# Altium schematic sheet [03] - RS232, JOYSTICK.SchDoc
size A4; DocumentNumber: 3; SheetNumber: 3; SheetTotal: 14
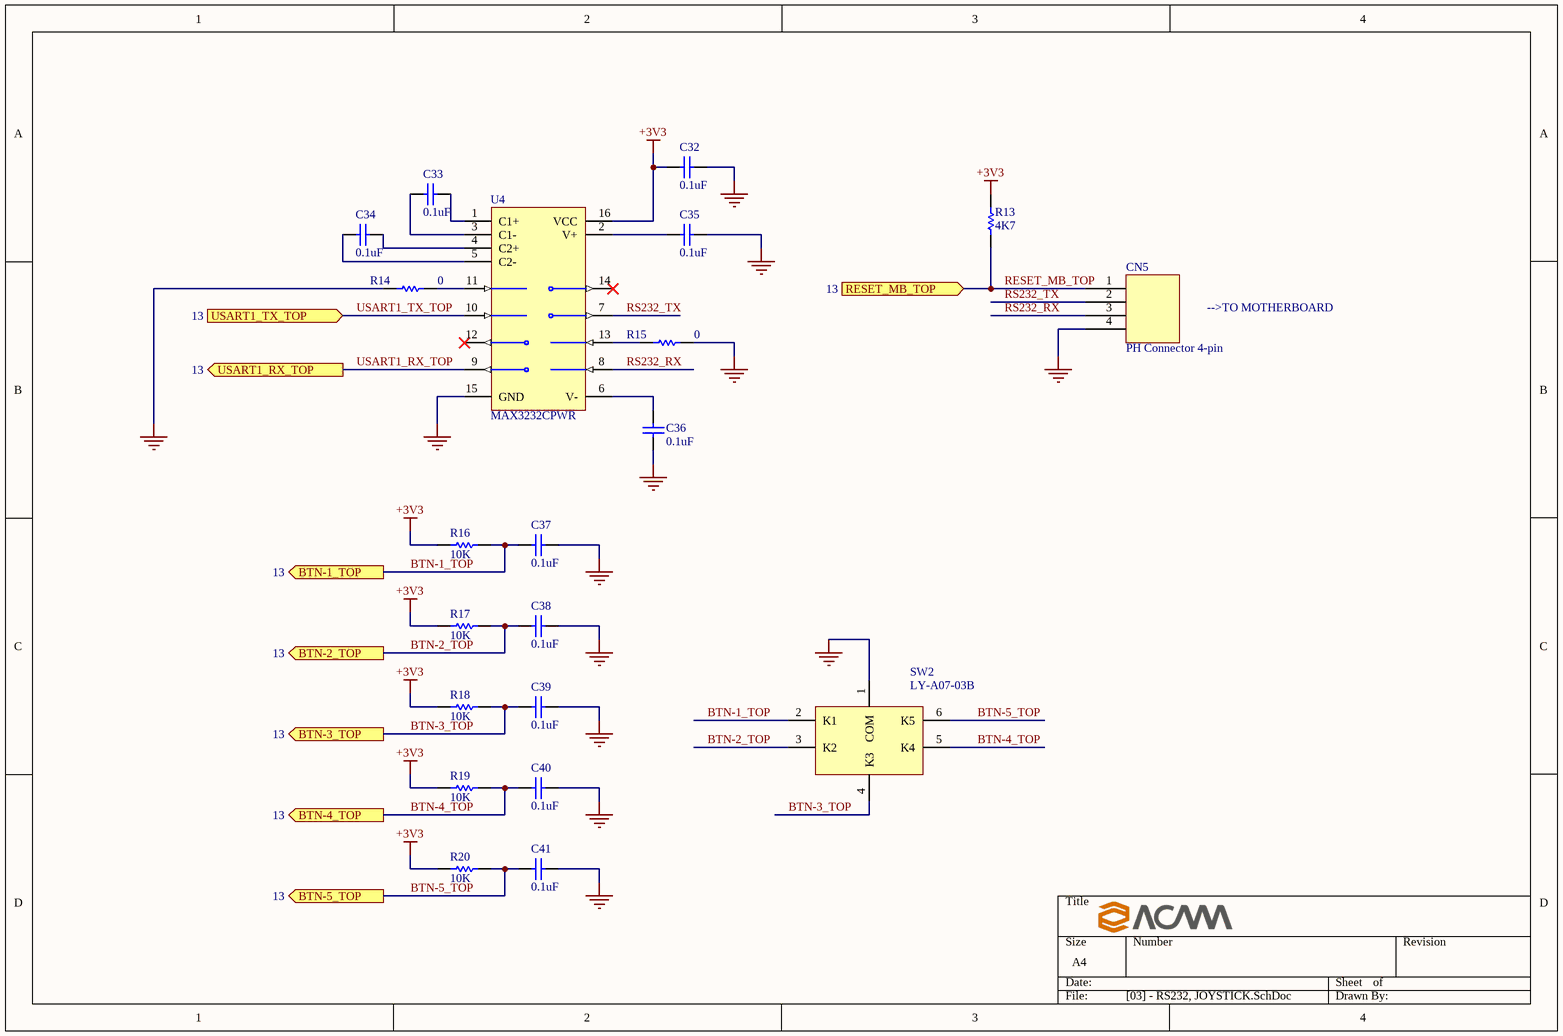
[diagram p0: [03] - RS232, JOYSTICK.SchDoc]

## Parts
C32  0.1uF  [0805_C_AUTO]
C33  0.1uF  [0805_C_AUTO]
C34  0.1uF  [0805_C_AUTO]
C35  0.1uF  [0805_C_AUTO]
C36  0.1uF  [0805_C_AUTO]
C37  0.1uF  [0805_C_AUTO]
C38  0.1uF  [0805_C_AUTO]
C39  0.1uF  [0805_C_AUTO]
C40  0.1uF  [0805_C_AUTO]
C41  0.1uF  [0805_C_AUTO]
CN5  PH Connector 4-pin  [PH_4PIN]
R13  4K7  [0805_R_AUTO]
R14  0  [0805_R_AUTO]
R15  0  [0805_R_AUTO]
R16  10K  [0805_R_AUTO]
R17  10K  [0805_R_AUTO]
R18  10K  [0805_R_AUTO]
R19  10K  [0805_R_AUTO]
R20  10K  [0805_R_AUTO]
SW2  LY-A07-03B  [LY-A07-03B]
U4  MAX3232CPWR  [TSSOP-16]

## Ports
BTN-1_TOP (out, see 13), BTN-2_TOP (out, see 13), BTN-3_TOP (out, see 13), BTN-4_TOP (out, see 13), BTN-5_TOP (out, see 13), RESET_MB_TOP (in, see 13), USART1_RX_TOP (out, see 13), USART1_TX_TOP (in, see 13)

## Nets
+3V3: C32.2 R13.1 R16.2 R17.2 R18.2 R19.2 R20.2 U4.16(VCC)
GND: C32.1 C35.1 C36.1 C37.1 C38.1 C39.1 C40.1 C41.1 CN5.4 R14.1 R15.2 SW2.1(COM) U4.15(GND)
BTN-1_TOP: C37.2 R16.1 SW2.2(K1) ; port BTN-1_TOP
BTN-2_TOP: C38.2 R17.1 SW2.3(K2) ; port BTN-2_TOP
BTN-3_TOP: C39.2 R18.1 SW2.4(K3) ; port BTN-3_TOP
BTN-4_TOP: C40.2 R19.1 SW2.5(K4) ; port BTN-4_TOP
BTN-5_TOP: C41.2 R20.1 SW2.6(K5) ; port BTN-5_TOP
RESET_MB_TOP: CN5.1 R13.2 ; port RESET_MB_TOP
RS232_RX: CN5.3 U4.8(R2IN)
RS232_TX: CN5.2 U4.7(T2OUT)
USART1_RX_TOP: U4.9(R2OUT) ; port USART1_RX_TOP
USART1_TX_TOP: U4.10(T2IN) ; port USART1_TX_TOP
NetC33_1: C33.1 U4.3(C1-)
NetC33_2: C33.2 U4.1(C1+)
NetC34_1: C34.1 U4.4(C2+)
NetC34_2: C34.2 U4.5(C2-)
NetC35_2: C35.2 U4.2(V+)
NetC36_2: C36.2 U4.6(V-)
NetR14_2: R14.2 U4.11(T1IN)
NetR15_1: R15.1 U4.13(R1IN)

Not connected (* = marked no-connect by the designer): U4 12(R1OUT)* 14(T1OUT)*

## Notes on the sheet
- -->TO MOTHERBOARD

## Library data of the parts
C32-C41 = Cap SMD: Non-Pol SMD Capacitor; RATED_VOLTAGE: 16V; Value: 0.1uF; Manufacturer Part Num: *
CN5 = PH Connector 4-pin: PH Connector , 4 pin, 2mm pitch, straight; Value: PH Connector 4-pin
R13-R20 = Res SMD: SMD Resistor; Tolerance: 5%; Manufacturer Part Num: *
  R13: Value: 4K7
  R14 R15: Value: 0
  R16-R20: Value: 10K
SW2 = KEY 5W: 5 Way Key; Value: LY-A07-03B
U4 = MAX3232: 3.0V TO 5.5V, Low-Power, up to 1Mbps, True RS-232 Transceiver Using Four 0.1µF External Capacitor; Value: MAX3232CPWR